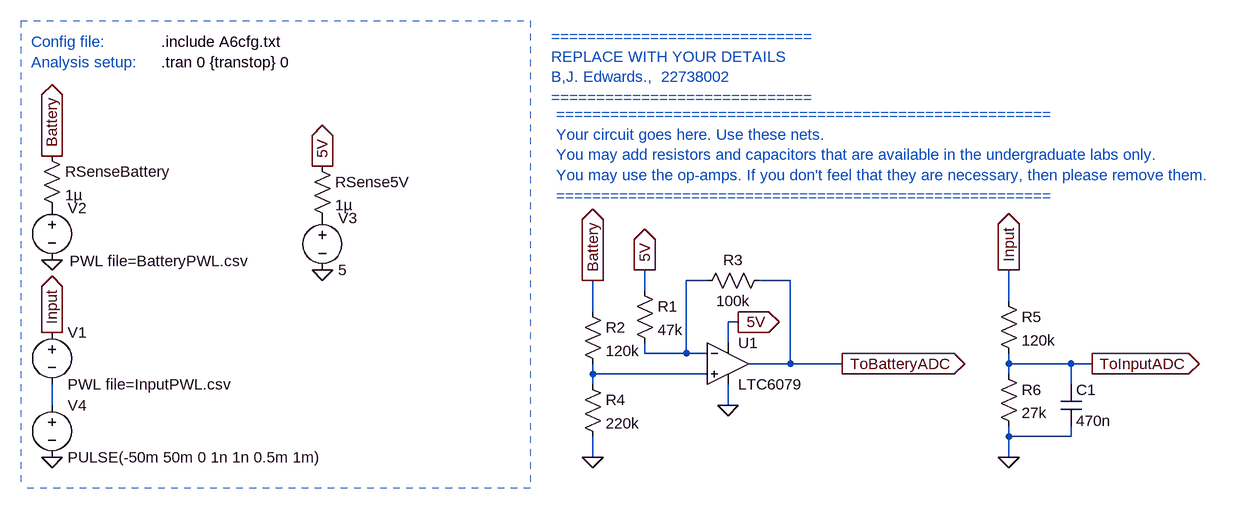
[diagram p0: schematic E344_22738002_A6.asc]
E344_22738002_A6.asc, the LTspice schematic file:
Version 4
SHEET 1 1824 680
WIRE -1312 -1024 -1344 -1024
WIRE -1184 -1024 -1232 -1024
WIRE -1408 -1008 -1408 -1040
WIRE -848 -992 -848 -1040
WIRE -1488 -976 -1488 -1024
WIRE -1264 -960 -1280 -960
WIRE -1280 -928 -1280 -960
WIRE -1408 -912 -1408 -928
WIRE -1344 -912 -1344 -1024
WIRE -1344 -912 -1408 -912
WIRE -1312 -912 -1344 -912
WIRE -1184 -896 -1184 -1024
WIRE -1184 -896 -1248 -896
WIRE -1104 -896 -1184 -896
WIRE -848 -896 -848 -912
WIRE -752 -896 -848 -896
WIRE -720 -896 -752 -896
WIRE -1488 -880 -1488 -896
WIRE -1312 -880 -1488 -880
WIRE -848 -880 -848 -896
WIRE -1488 -864 -1488 -880
WIRE -752 -864 -752 -896
WIRE -2320 -832 -2320 -864
WIRE -1280 -832 -1280 -864
WIRE -848 -784 -848 -800
WIRE -752 -784 -752 -800
WIRE -752 -784 -848 -784
WIRE -1488 -752 -1488 -784
WIRE -848 -752 -848 -784
FLAG -2320 -944 Input
IOPIN -2320 -944 Out
FLAG -1904 -1040 0
FLAG -1488 -752 0
FLAG -2320 -752 0
FLAG -2320 -1056 0
FLAG -720 -896 ToInputADC
IOPIN -720 -896 Out
FLAG -1104 -896 ToBatteryADC
IOPIN -1104 -896 Out
FLAG -1904 -1200 5V
IOPIN -1904 -1200 Out
FLAG -2320 -1216 Battery
IOPIN -2320 -1216 Out
FLAG -1488 -1024 Battery
IOPIN -1488 -1024 Out
FLAG -848 -1040 Input
IOPIN -848 -1040 Out
FLAG -1264 -960 5V
IOPIN -1264 -960 Out
FLAG -1280 -832 0
FLAG -1408 -1040 5V
IOPIN -1408 -1040 Out
FLAG -848 -752 0
SYMBOL voltage -2320 -960 R0
WINDOW 123 0 0 Left 0
WINDOW 39 0 0 Left 0
SYMATTR InstName V1
SYMATTR Value PWL file=InputPWL.csv
SYMBOL voltage -2320 -1152 R0
WINDOW 123 0 0 Left 0
WINDOW 39 0 0 Left 0
WINDOW 3 27 98 Left 2
SYMATTR Value PWL file=BatteryPWL.csv
SYMATTR InstName V2
SYMBOL voltage -1904 -1136 R0
WINDOW 123 0 0 Left 0
WINDOW 39 0 0 Left 0
SYMATTR InstName V3
SYMATTR Value 5
SYMBOL voltage -2320 -848 R0
WINDOW 123 0 0 Left 0
WINDOW 39 0 0 Left 0
SYMATTR InstName V4
SYMATTR Value PULSE(-50m 50m 0 1n 1n 0.5m 1m)
SYMBOL res -1920 -1216 R0
SYMATTR InstName RSense5V
SYMATTR Value 1µ
SYMBOL res -2336 -1232 R0
SYMATTR InstName RSenseBattery
SYMATTR Value 1µ
SYMBOL OpAmps\\LTC6079 -1280 -896 R0
SYMATTR InstName U1
SYMBOL res -1424 -1024 R0
SYMATTR InstName R1
SYMATTR Value 47k
SYMBOL res -1504 -992 R0
SYMATTR InstName R2
SYMATTR Value 120k
SYMBOL res -1328 -1008 R270
WINDOW 0 32 56 VTop 2
WINDOW 3 0 56 VBottom 2
SYMATTR InstName R3
SYMATTR Value 100k
SYMBOL res -1504 -880 R0
SYMATTR InstName R4
SYMATTR Value 220k
SYMBOL res -864 -1008 R0
SYMATTR InstName R5
SYMATTR Value 120k
SYMBOL res -864 -896 R0
SYMATTR InstName R6
SYMATTR Value 27k
SYMBOL cap -768 -864 R0
SYMATTR InstName C1
SYMATTR Value 470n
TEXT -2152 -1360 Left 2 !.tran 0 {transtop} 0
TEXT -2152 -1392 Left 2 !.include A6cfg.txt
TEXT -2352 -1392 Left 2 ;Config file:
TEXT -2352 -1360 Left 2 ;Analysis setup:
TEXT -1552 -1400 Left 2 ;=============================\nREPLACE WITH YOUR DETAILS\nB,J. Edwards.,  22738002\n=============================
TEXT -1544 -1280 Left 2 ;=======================================================\nYour circuit goes here. Use these nets.\nYou may add resistors and capacitors that are available in the undergraduate labs only.\nYou may use the op-amps. If you don't feel that they are necessary, then please remove them.\n=======================================================
LINE Normal -1584 -1424 -1584 -704 2
LINE Normal -2368 -1424 -1584 -1424 2
LINE Normal -1584 -704 -2368 -704 2
LINE Normal -1584 -720 -1584 -720 2
LINE Normal -2368 -1424 -2368 -704 2

The netlist it stands for:
* E344_22738002_A6.asc
V1 Input N003 PWL file=InputPWL.csv
V2 P001 0 PWL file=BatteryPWL.csv
V3 P002 0 5
V4 N003 0 PULSE(-50m 50m 0 1n 1n 0.5m 1m)
RSense5V 5V P002 1µ
RSenseBattery Battery P001 1µ
XU1 N002 N001 5V 0 ToBatteryADC LTC6078  ; LTC6079, pins In+ In- V+ V- OUT
R1 5V N001 47k
R2 Battery N002 120k
R3 N001 ToBatteryADC 100k
R4 N002 0 220k
R5 Input ToInputADC 120k
R6 ToInputADC 0 27k
C1 ToInputADC 0 470n
.tran 0 {transtop} 0
.include A6cfg.txt
* Config file:
* Analysis setup:
* =============================
* REPLACE WITH YOUR DETAILS
* B,J. Edwards.,  22738002
* =============================
* =======================================================
* Your circuit goes here. Use these nets.
* You may add resistors and capacitors that are available in the undergraduate labs only.
* You may use the op-amps. If you don't feel that they are necessary, then please remove them.
* =======================================================
.lib LTC5.lib
.backanno
.end